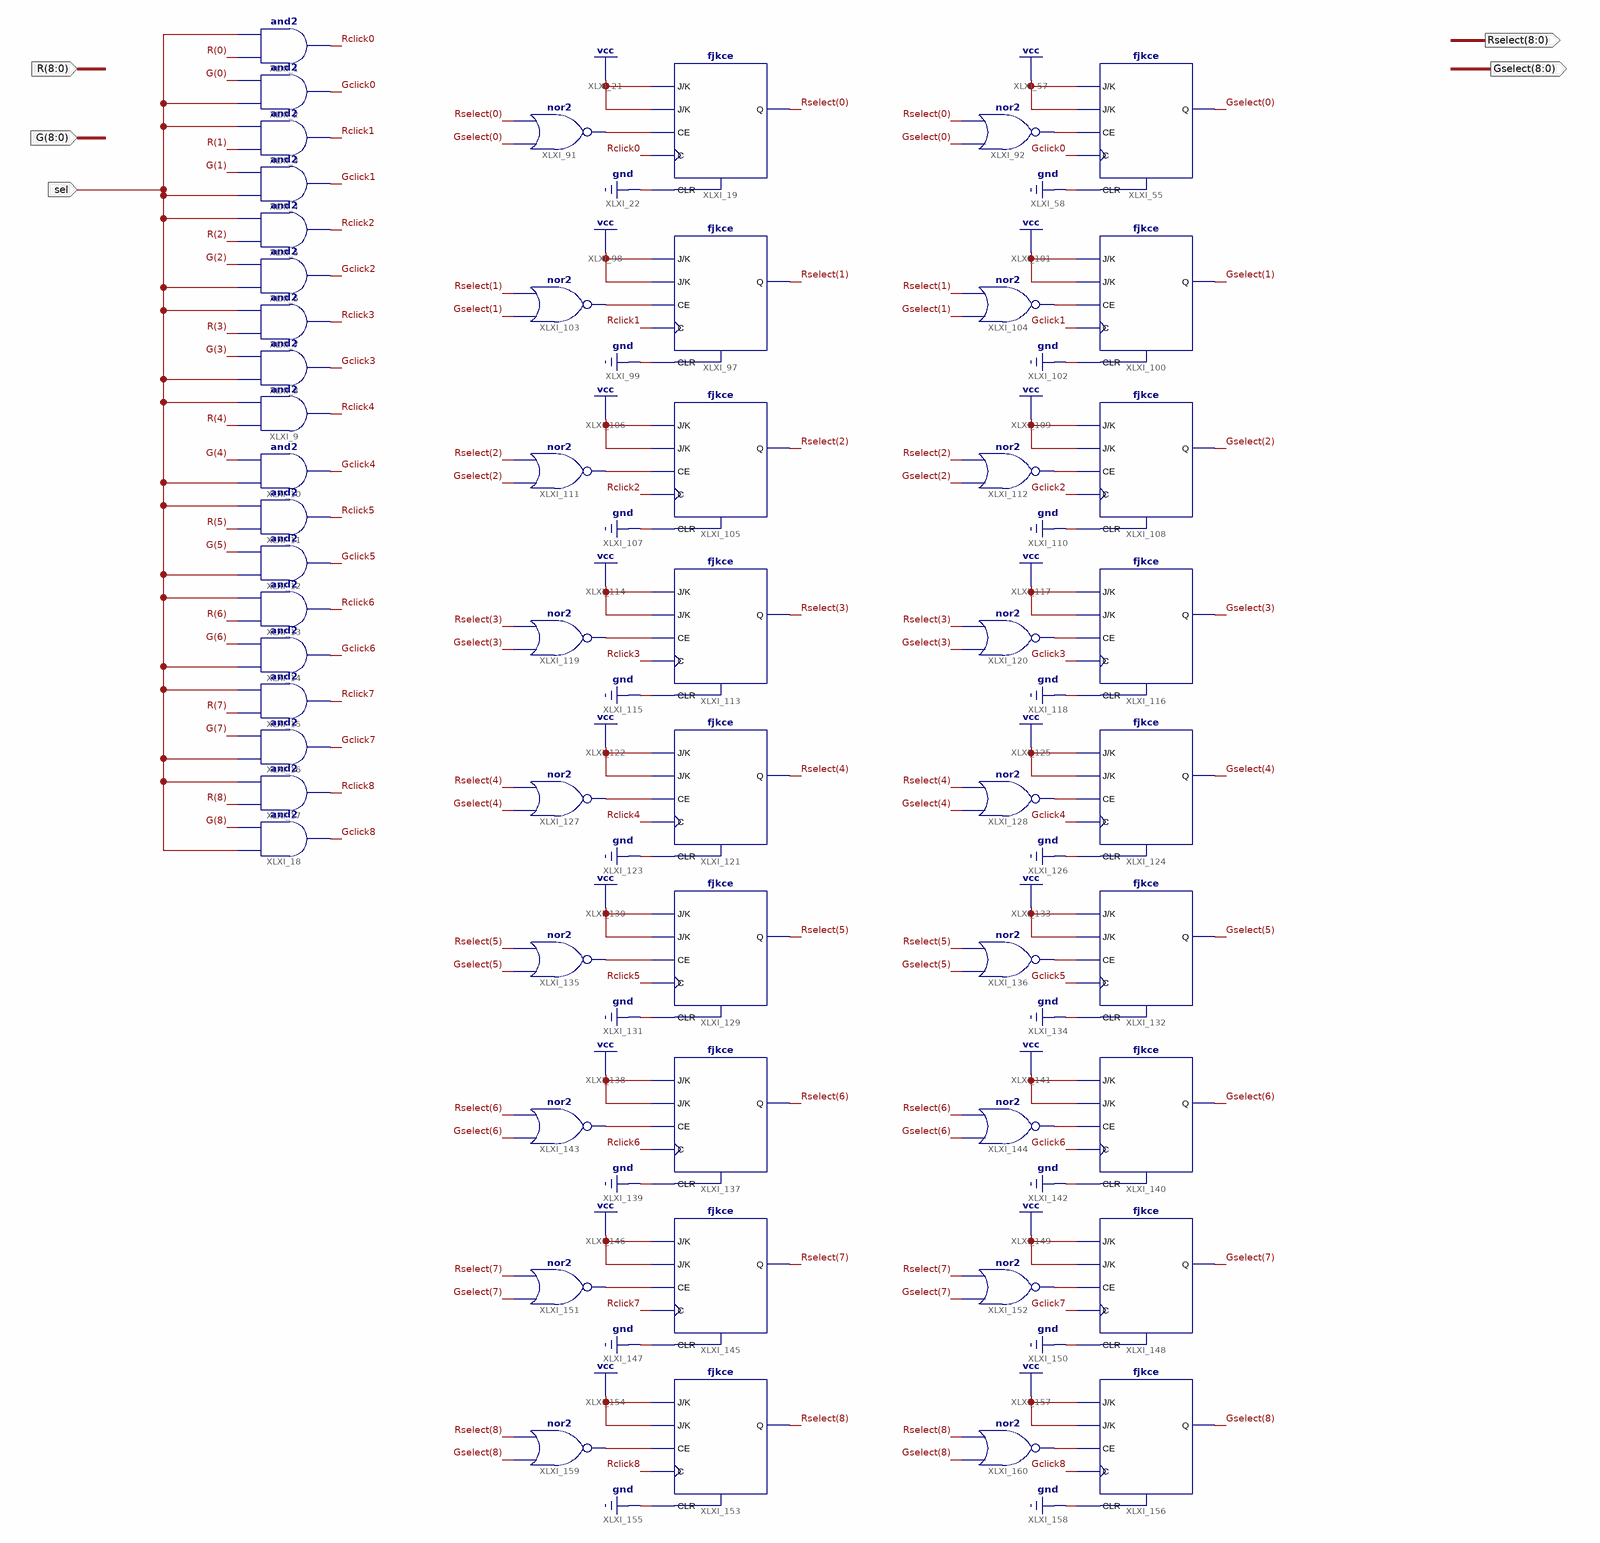
[diagram p0: schematic sheet 1]
// Xilinx ISE schematic chooseData.sch (spartan6) as structural Verilog: 54 symbols, 5 ports
module chooseData (
  input  [8:0] R,
  input  [8:0] G,
  input  sel,
  output [8:0] Rselect,
  output [8:0] Gselect
);

  wire Gclick0, Gclick1, Gclick2, Gclick3, Gclick4, Gclick5, Gclick6, Gclick7, Gclick8, Rclick0, Rclick1,
       Rclick2, Rclick3, Rclick4, Rclick5, Rclick6, Rclick7, Rclick8, XLXN_23, XLXN_89, XLXN_145, XLXN_150,
       XLXN_159, XLXN_164, XLXN_173, XLXN_178, XLXN_187, XLXN_192, XLXN_201, XLXN_206, XLXN_215, XLXN_220,
       XLXN_229, XLXN_234, XLXN_243, XLXN_248;

  and XLXI_1 (Rclick0, R[0], sel);
  and XLXI_2 (Gclick0, sel, G[0]);
  and XLXI_3 (Rclick1, R[1], sel);
  and XLXI_4 (Gclick1, sel, G[1]);
  and XLXI_5 (Rclick2, R[2], sel);
  and XLXI_6 (Gclick2, sel, G[2]);
  and XLXI_7 (Rclick3, R[3], sel);
  and XLXI_8 (Gclick3, sel, G[3]);
  and XLXI_9 (Rclick4, R[4], sel);
  and XLXI_10 (Gclick4, sel, G[4]);
  and XLXI_11 (Rclick5, R[5], sel);
  and XLXI_12 (Gclick5, sel, G[5]);
  and XLXI_13 (Rclick6, R[6], sel);
  and XLXI_14 (Gclick6, sel, G[6]);
  and XLXI_15 (Rclick7, R[7], sel);
  and XLXI_16 (Gclick7, sel, G[7]);
  and XLXI_17 (Rclick8, R[8], sel);
  and XLXI_18 (Gclick8, sel, G[8]);
  fjkce XLXI_19 (.C(Rclick0), .CE(XLXN_23), .CLR(1'b0), .J(1'b1), .K(1'b1), .Q(Rselect[0]));
  fjkce XLXI_55 (.C(Gclick0), .CE(XLXN_89), .CLR(1'b0), .J(1'b1), .K(1'b1), .Q(Gselect[0]));
  nor XLXI_91 (XLXN_23, Gselect[0], Rselect[0]);
  nor XLXI_92 (XLXN_89, Gselect[0], Rselect[0]);
  fjkce XLXI_97 (.C(Rclick1), .CE(XLXN_145), .CLR(1'b0), .J(1'b1), .K(1'b1), .Q(Rselect[1]));
  fjkce XLXI_100 (.C(Gclick1), .CE(XLXN_150), .CLR(1'b0), .J(1'b1), .K(1'b1), .Q(Gselect[1]));
  nor XLXI_103 (XLXN_145, Gselect[1], Rselect[1]);
  nor XLXI_104 (XLXN_150, Gselect[1], Rselect[1]);
  fjkce XLXI_105 (.C(Rclick2), .CE(XLXN_159), .CLR(1'b0), .J(1'b1), .K(1'b1), .Q(Rselect[2]));
  fjkce XLXI_108 (.C(Gclick2), .CE(XLXN_164), .CLR(1'b0), .J(1'b1), .K(1'b1), .Q(Gselect[2]));
  nor XLXI_111 (XLXN_159, Gselect[2], Rselect[2]);
  nor XLXI_112 (XLXN_164, Gselect[2], Rselect[2]);
  fjkce XLXI_113 (.C(Rclick3), .CE(XLXN_173), .CLR(1'b0), .J(1'b1), .K(1'b1), .Q(Rselect[3]));
  fjkce XLXI_116 (.C(Gclick3), .CE(XLXN_178), .CLR(1'b0), .J(1'b1), .K(1'b1), .Q(Gselect[3]));
  nor XLXI_119 (XLXN_173, Gselect[3], Rselect[3]);
  nor XLXI_120 (XLXN_178, Gselect[3], Rselect[3]);
  fjkce XLXI_121 (.C(Rclick4), .CE(XLXN_187), .CLR(1'b0), .J(1'b1), .K(1'b1), .Q(Rselect[4]));
  fjkce XLXI_124 (.C(Gclick4), .CE(XLXN_192), .CLR(1'b0), .J(1'b1), .K(1'b1), .Q(Gselect[4]));
  nor XLXI_127 (XLXN_187, Gselect[4], Rselect[4]);
  nor XLXI_128 (XLXN_192, Gselect[4], Rselect[4]);
  fjkce XLXI_129 (.C(Rclick5), .CE(XLXN_201), .CLR(1'b0), .J(1'b1), .K(1'b1), .Q(Rselect[5]));
  fjkce XLXI_132 (.C(Gclick5), .CE(XLXN_206), .CLR(1'b0), .J(1'b1), .K(1'b1), .Q(Gselect[5]));
  nor XLXI_135 (XLXN_201, Gselect[5], Rselect[5]);
  nor XLXI_136 (XLXN_206, Gselect[5], Rselect[5]);
  fjkce XLXI_137 (.C(Rclick6), .CE(XLXN_215), .CLR(1'b0), .J(1'b1), .K(1'b1), .Q(Rselect[6]));
  fjkce XLXI_140 (.C(Gclick6), .CE(XLXN_220), .CLR(1'b0), .J(1'b1), .K(1'b1), .Q(Gselect[6]));
  nor XLXI_143 (XLXN_215, Gselect[6], Rselect[6]);
  nor XLXI_144 (XLXN_220, Gselect[6], Rselect[6]);
  fjkce XLXI_145 (.C(Rclick7), .CE(XLXN_229), .CLR(1'b0), .J(1'b1), .K(1'b1), .Q(Rselect[7]));
  fjkce XLXI_148 (.C(Gclick7), .CE(XLXN_234), .CLR(1'b0), .J(1'b1), .K(1'b1), .Q(Gselect[7]));
  nor XLXI_151 (XLXN_229, Gselect[7], Rselect[7]);
  nor XLXI_152 (XLXN_234, Gselect[7], Rselect[7]);
  fjkce XLXI_153 (.C(Rclick8), .CE(XLXN_243), .CLR(1'b0), .J(1'b1), .K(1'b1), .Q(Rselect[8]));
  fjkce XLXI_156 (.C(Gclick8), .CE(XLXN_248), .CLR(1'b0), .J(1'b1), .K(1'b1), .Q(Gselect[8]));
  nor XLXI_159 (XLXN_243, Gselect[8], Rselect[8]);
  nor XLXI_160 (XLXN_248, Gselect[8], Rselect[8]);
endmodule
